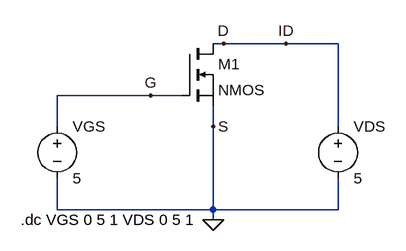
[diagram p0: schematic NMOS.asc]
NMOS.asc, the LTspice schematic file:
Version 4
SHEET 1 880 680
WIRE 352 192 336 192
WIRE 448 192 352 192
WIRE 528 192 448 192
WIRE 240 272 96 272
WIRE 288 272 240 272
WIRE 96 320 96 272
WIRE 336 320 336 288
WIRE 528 320 528 192
WIRE 96 448 96 400
WIRE 336 448 336 320
WIRE 336 448 96 448
WIRE 528 448 528 400
WIRE 528 448 336 448
WIRE 336 464 336 448
FLAG 336 464 0
FLAG 240 272 G
FLAG 352 192 D
FLAG 336 320 S
FLAG 448 192 ID
SYMBOL voltage 96 304 R0
SYMATTR InstName VGS
SYMATTR Value 5
SYMBOL voltage 528 304 R0
SYMATTR InstName VDS
SYMATTR Value 5
SYMBOL nmos 288 192 R0
SYMATTR InstName M1
TEXT 40 464 Left 2 !.dc VGS 0 5 1 VDS 0 5 1

The netlist it stands for:
* NMOS.asc
VGS G 0 5
VDS ID 0 5
M1 ID G 0 0 NMOS
.model NMOS NMOS
.model PMOS PMOS
.lib standard.mos
.dc VGS 0 5 1 VDS 0 5 1
.backanno
.end